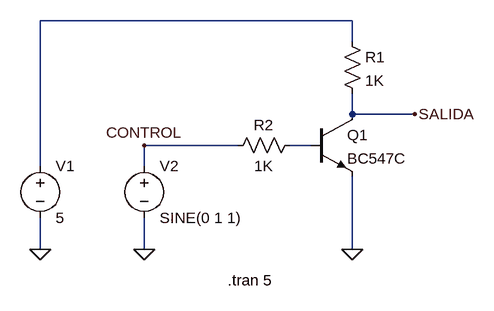
[diagram p0: schematic transistor-interruptor.asc]
transistor-interruptor.asc, the LTspice schematic file:
Version 4
SHEET 1 880 680
WIRE 240 -16 -240 -16
WIRE 240 16 240 -16
WIRE 240 128 240 96
WIRE 336 128 240 128
WIRE 64 176 -80 176
WIRE 176 176 144 176
WIRE -240 208 -240 -16
WIRE -80 208 -80 176
WIRE -240 336 -240 288
WIRE -80 336 -80 288
WIRE 240 336 240 224
FLAG -80 336 0
FLAG 240 336 0
FLAG -240 336 0
FLAG 336 128 SALIDA
FLAG -80 176 CONTROL
SYMBOL npn 176 128 R0
SYMATTR InstName Q1
SYMATTR Value BC547C
SYMBOL res 224 0 R0
SYMATTR InstName R1
SYMATTR Value 1K
SYMBOL res 160 160 R90
WINDOW 0 0 56 VBottom 2
WINDOW 3 32 56 VTop 2
SYMATTR InstName R2
SYMATTR Value 1K
SYMBOL voltage -240 192 R0
WINDOW 123 0 0 Left 0
WINDOW 39 0 0 Left 0
SYMATTR InstName V1
SYMATTR Value 5
SYMBOL voltage -80 192 R0
WINDOW 123 0 0 Left 0
WINDOW 39 0 0 Left 0
SYMATTR InstName V2
SYMATTR Value SINE(0 1 1)
TEXT 48 384 Left 2 !.tran 5

The netlist it stands for:
* transistor-interruptor.asc
Q1 SALIDA N002 0 0 BC547C
R1 N001 SALIDA 1K
R2 N002 CONTROL 1K
V1 N001 0 5
V2 CONTROL 0 SINE(0 1 1)
.model NPN NPN
.model PNP PNP
.lib standard.bjt
.tran 5
.backanno
.end